# EasyEDA schematic SCH_ELECTROSCOPE_2025-04-18.json
TITLE: Smart-Qmeter; REV: 1.0; Date: 2025-04-18; Sheet: 1/1; Drawn By: dr. Károly Piláth; Company: -
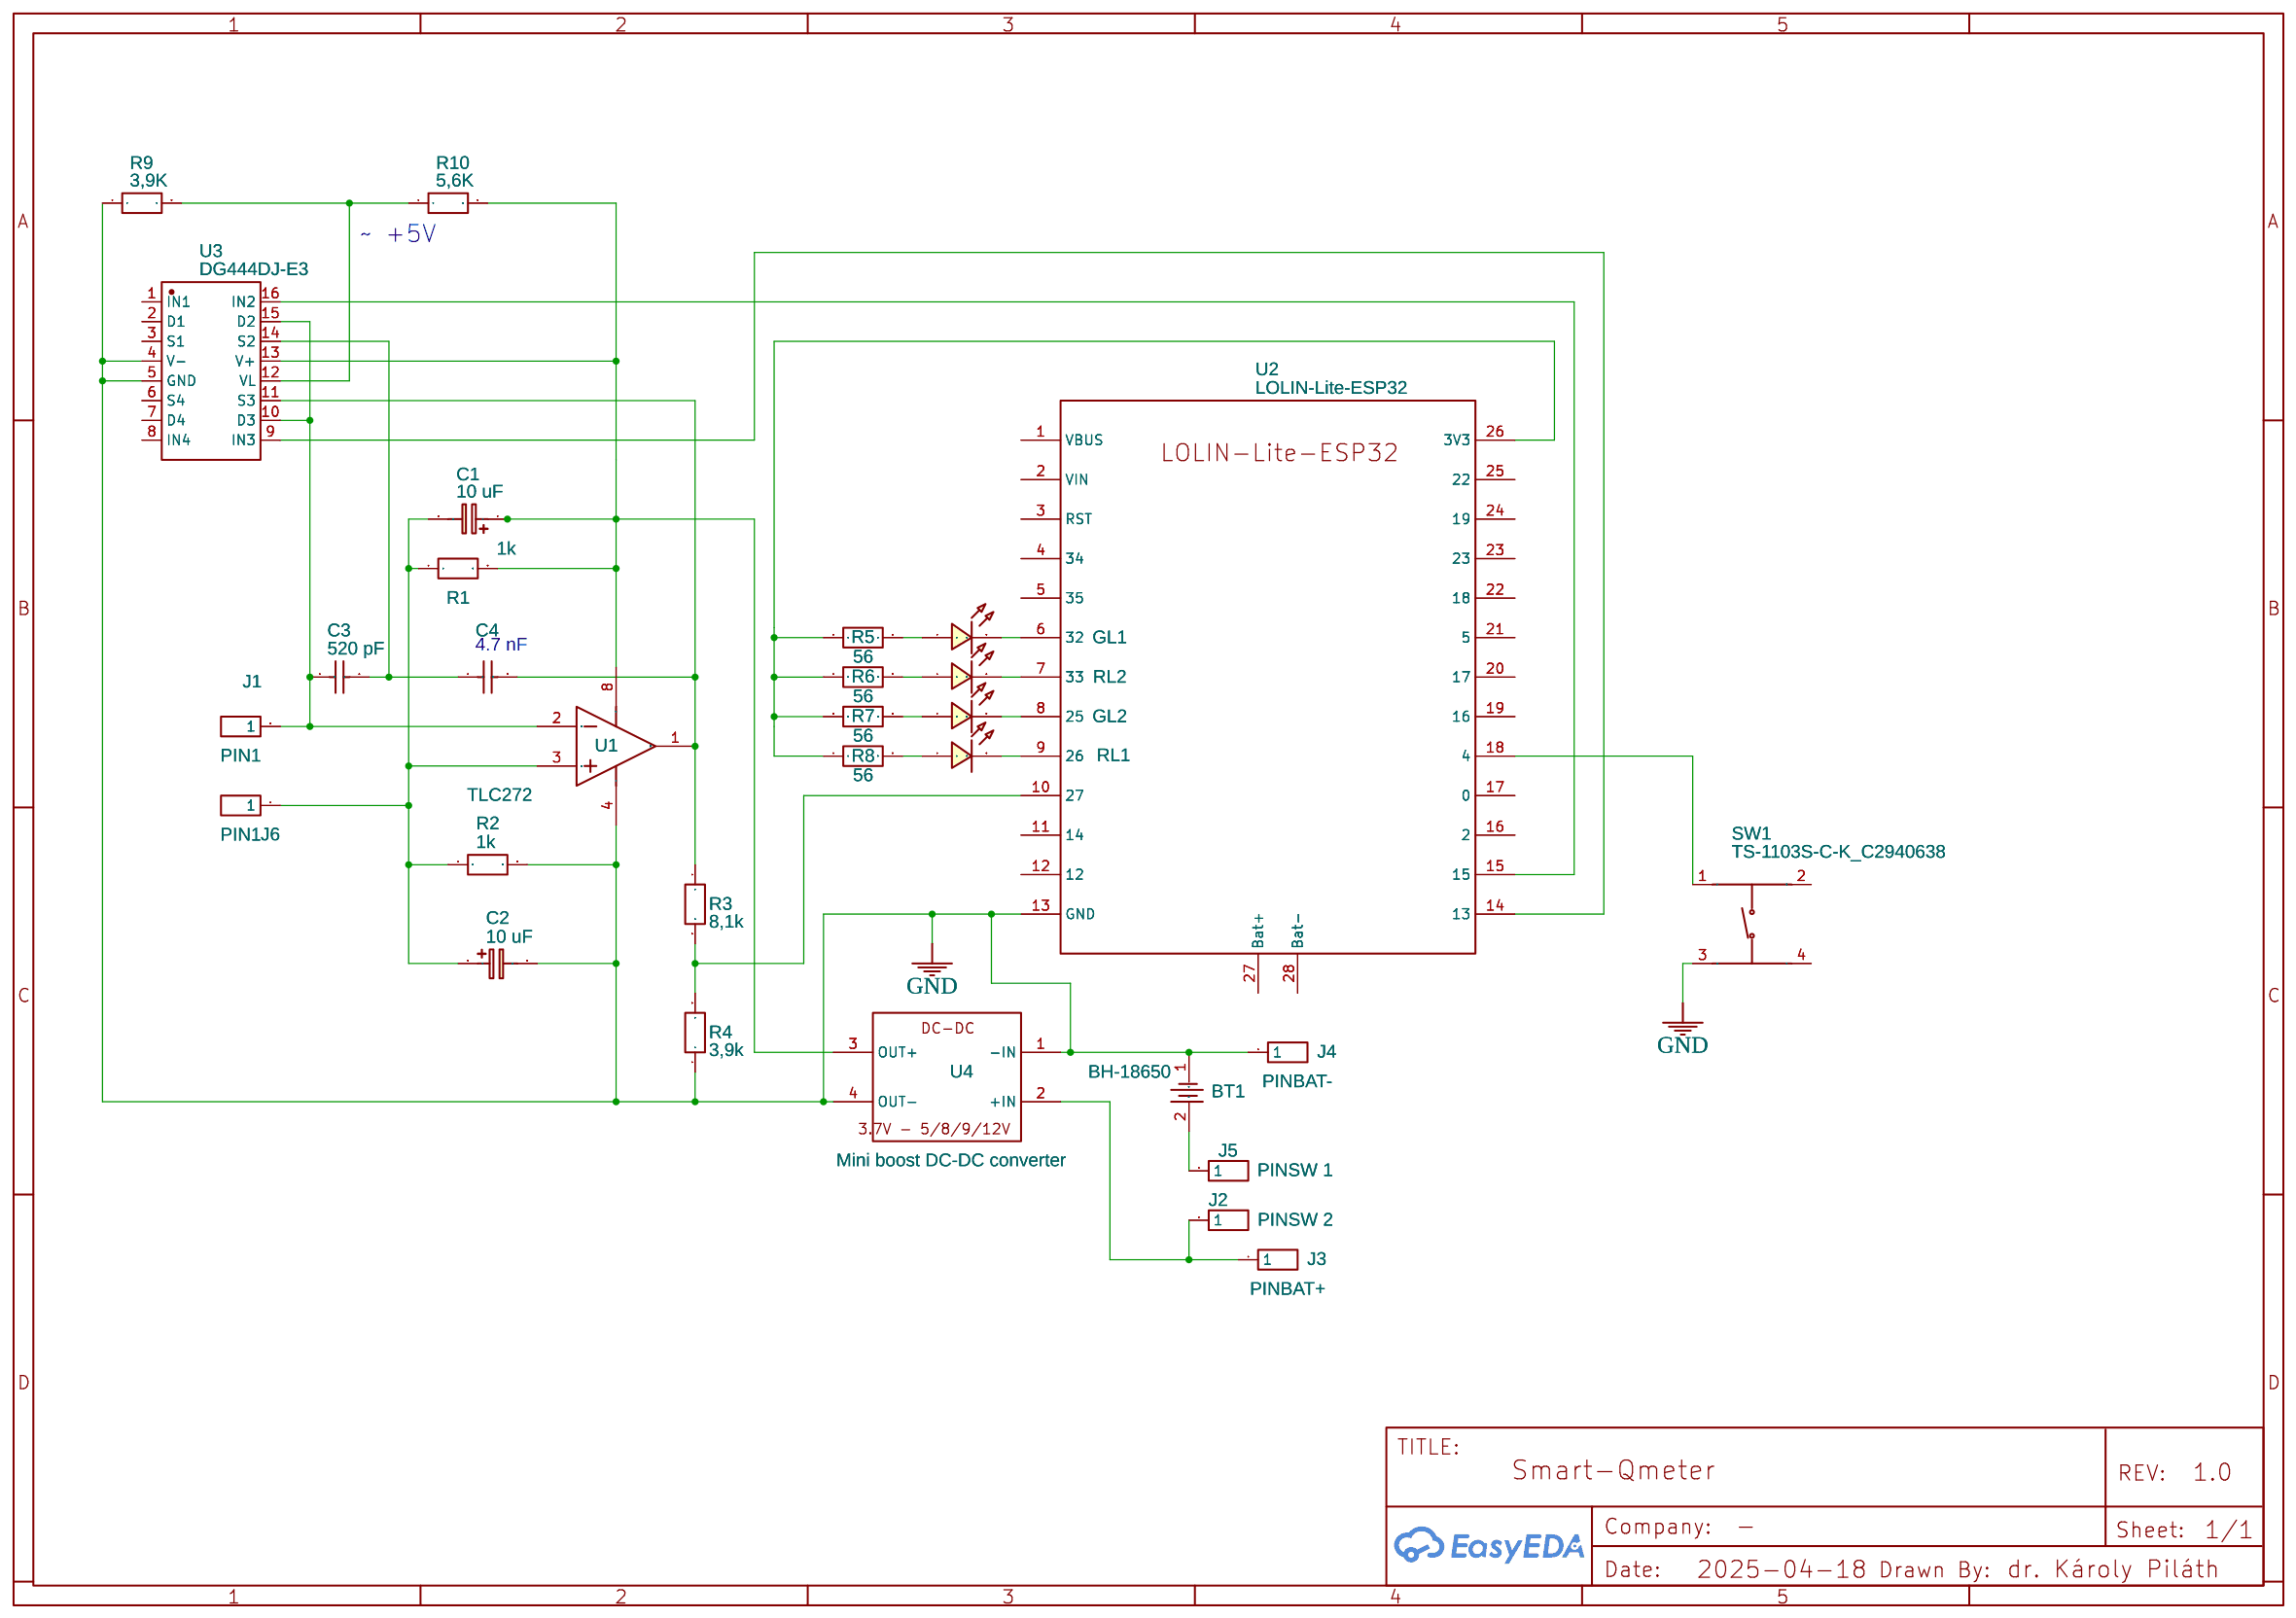
[diagram p0: schematic sheet]

## Parts
BT1  BH-18650  [BATTERY-SMD_18650-1S-L77.1-W20.7-1]
C1  10 uF  [CAP-D4.0×F1.5]
C2  10 uF  [CAP-D4.0×F1.5]
C3  520 pF  [CAP-TH_L6.5-W4.0-P5.00-D1.0]
C4  10 nF  [CAP-TH_L6.5-W4.0-P5.00-D1.0]
GL1  LED-TH-5mm_R  [LED-TH_BD5.0_RED]
GL2  LED-TH-5mm_R  [LED-TH_BD5.0_RED]
J1  PIN1  [HDR-M-2.54_1X1]
J2  PINSW 2  [HDR-M-2.54_1X1]
J3  PINBAT+  [HDR-M-2.54_1X1]
J4  PINBAT-  [HDR-M-2.54_1X1]
J5  PINSW 1  [HDR-M-2.54_1X1]
J6  PIN1  [HDR-M-2.54_1X1]
R1  1k  [R_AXIAL-0.4]
R2  1k  [R_AXIAL-0.4]
R3  8,1k  [R_AXIAL-0.4]
R4  3,9k  [R_AXIAL-0.4]
R5  56  [R_AXIAL-0.4]
R6  56  [R_AXIAL-0.4]
R7  56  [R_AXIAL-0.4]
R8  56  [R_AXIAL-0.4]
R9  3,9K  [R_AXIAL-0.4]
R10  5,6K  [R_AXIAL-0.4]
RL1  LED-TH-5mm_R  [LED-TH_BD5.0_RED]
RL2  LED-TH-5mm_R  [LED-TH_BD5.0_RED]
SW1  TS-1103S-C-K_C2940638  [KEY-SMD_4P-L12.0-W12.0-P5.00-LS15.4]
U1  TLC272  [PDIP-8_L10.2-W5.9-P2.54-LS7.6-BL]
U2  LOLIN-Lite-ESP32  [LOLIN32-LITE]
U3  DG444DJ-E3  [DIP-16_L20.0-W6.4-P2.54-LS7.6-BL]
U4  Mini boost DC-DC converter  [MINI BOOST DC-ВС CONVERTER]

## Library data of the parts
BT1 = BH-18650-B1BA002: Contributor: lcsc; Supplier: LCSC; Supplier Part: C2988620; Manufacturer: MYOUNG(美阳); JLCPCB Part Class: Extended Part
C1 C2 = CE_TH_D4.0×F1.5_EU: Contributor: LCEDA_Lib
C3 C4 = CAPACITOR15NF100V: Contributor: LCSC; Supplier: LCSC; Manufacturer: ReliaPro; Manufacturer Part: Capacitor15nf100v; Supplier Part: C26191
GL1 GL2 RL1 RL2 = LED-TH-5mm_R: Manufacturer: EVERLIGHT(台湾亿光); Manufacturer Part: 333-2SURD/S530-A3; Supplier Part: C87271; Supplier: LCSC; Contributor: LCEDA_Lib
J1-J6 = HDR-M-2.54_1x1: Supplier Part: C81276; Supplier: LCSC; Contributor: LCEDA_Lib
R1-R10 = R_AXIAL-0.4_EU: Contributor: LCEDA_Lib
SW1 = TS-1103S-C-K_C2940638: Contributor: LCSC; Supplier: LCSC; Supplier Part: C2940638; Manufacturer: XKB Connectivity(中国星坤); Manufacturer Part: TS-1103S-C-K; JLCPCB Part Class: Extended Part
U1 = TL062CPE4: subpart_no: 1; Supplier: LCSC; Supplier Part: C4370545; Manufacturer: TI(德州仪器)
U2 = LOLIN-Lite-ESP32: Manufacturer: Wemos; Contributor: jesusado
U3 = DG444DJ-E3: Contributor: LCSC; Supplier: LCSC; Supplier Part: C1546588; Manufacturer: VISHAY(威世); JLCPCB Part Class: Extended Part
U4 = Mini boost DC-DC converter: Contributor: fancarver

## Nets
GND: BT1.1 C2.2 J4.1 R2.2 R4.1 R9.1 SW1.3 U1.4(V-) U2.13(GND) U3.4(V-) U3.5(GND) U4.1(-IN) U4.4(OUT-)
Net-(BT1-2): BT1.2 J5.1
Net-(C1-1): C1.1 R1.2 R10.2 U1.8(V+) U3.13(V+) U4.3(OUT+)
Net-(C1-2): C1.2 C2.1 J6.1 R1.1 R2.1 U1.3(INA+)
Net-(C3-1): C3.1 J1.1 U1.2(INA -) U3.10(D3) U3.15(D2)
Net-(C3-2): C3.2 C4.1 U3.14(S2)
Net-(C4-2): C4.2 R3.1 U1.1(OUTA) U3.11(S3)
Net-(GL1-1): GL1.1 R5.2
Net-(GL1-2): GL1.2 U2.6(32)
Net-(GL2-1): GL2.1 R7.2
Net-(GL2-2): GL2.2 U2.8(25)
Net-(J2-1): J2.1 J3.1 U4.2(+IN)
Net-(R3-2): R3.2 R4.2 U2.10(27)
Net-(R5-1): R5.1 R6.1 R7.1 R8.1 U2.26(3V3)
Net-(R6-2): R6.2 RL2.1
Net-(R8-2): R8.2 RL1.1
Net-(R9-2): R9.2 R10.1 U3.12(VL)
Net-(RL1-2): RL1.2 U2.9(26)
Net-(RL2-2): RL2.2 U2.7(33)
Net-(SW1-1): SW1.1 U2.18(4)
Net-(U2-14): U2.14(13) U3.9(IN3)
Net-(U2-15): U2.15 U3.16(IN2)

Not connected (* = marked no-connect by the designer): SW1 2 4; U2 1(VBUS) 2(VIN) 3(RST) 4(34) 5(35) 11(14) 12 16(2) 17(0) 19(16) 20(17) 21(5) 22(18) 23 24(19) 25(22) 27(Bat+) 28(Bat-); U3 1(IN1) 2(D1) 3(S1) 6(S4) 7(D4) 8(IN4)

## Notes on the sheet
- ~ +5V
- 4.7 nF
